# Altium project HVManager.PrjPcb
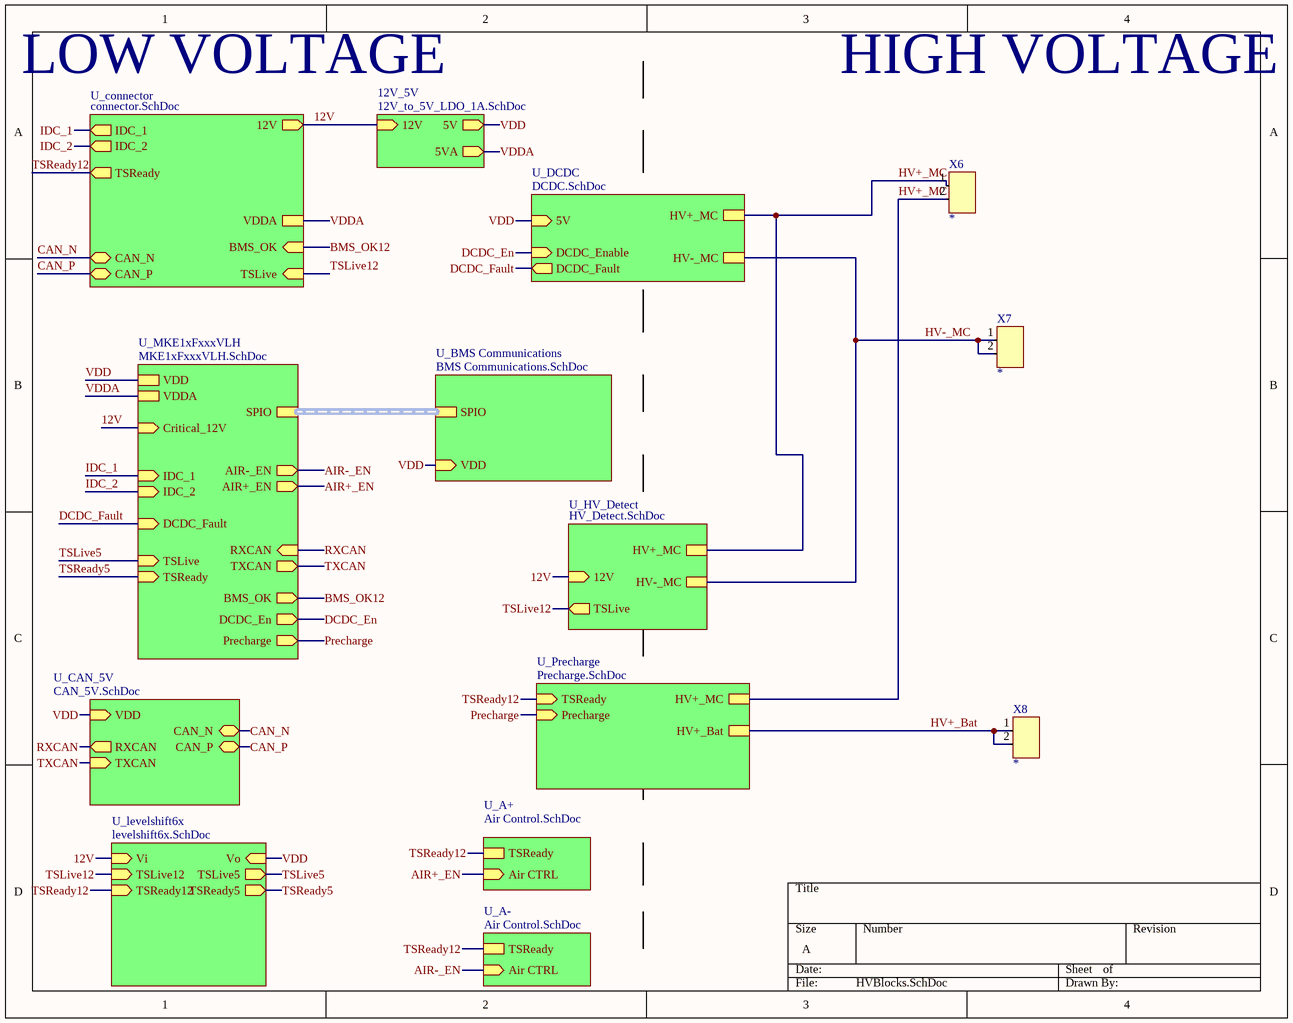
[diagram p0: HVBlocks.SchDoc]
11 sheets, 79 parts. Net scope: hierarchical (ports join the sheet entries above them; power ports are global).
Board file: HV_Manager.PcbDoc
Sheets:
  HVBlocks.SchDoc
    U_A- = Air Control.SchDoc
    U_A+ = Air Control.SchDoc
    U_MKE1xFxxxVLH = MKE1xFxxxVLH.SchDoc
    U_BMS Communications = BMS Communications.SchDoc
    U_connector = connector.SchDoc
    12V_5V = 12V_to_5V_LDO_1A.SchDoc
    U_levelshift6x = levelshift6x.SchDoc
    U_CAN_5V = CAN_5V.SchDoc
    U_DCDC = DCDC.SchDoc
    U_HV_Detect = HV_Detect.SchDoc
    U_Precharge = Precharge.SchDoc

## Sheet HVBlocks.SchDoc
size A

### Parts
X6  *  [CONN 43650-0200 MOLEX 2PIN]
X7  *  [CONN 43650-0200 MOLEX 2PIN]
X8  *  [CONN 43650-0200 MOLEX 2PIN]

### Sub-sheets
12V_5V = 12V_to_5V_LDO_1A.SchDoc: 12V (in), 5V (out), 5VA (out)
U_A+ = Air Control.SchDoc: TSReady, Air CTRL (in)
U_A- = Air Control.SchDoc: TSReady, Air CTRL (in)
U_BMS Communications = BMS Communications.SchDoc: SPIO (harness *), VDD (in)
U_CAN_5V = CAN_5V.SchDoc: TXCAN (in), RXCAN (out), CAN_N (bidir), CAN_P (bidir), VDD (in)
U_connector = connector.SchDoc: 12V (out), TSLive (in), IDC_1 (out), IDC_2 (out), VDDA, CAN_N (bidir), CAN_P (bidir), TSReady (out), BMS_OK (in)
U_DCDC = DCDC.SchDoc: DCDC_Enable (in), HV+_MC, HV-_MC, DCDC_Fault (out), 5V (in)
U_HV_Detect = HV_Detect.SchDoc: HV+_MC, HV-_MC, 12V (in), TSLive (out)
U_levelshift6x = levelshift6x.SchDoc: Vi (in), TSLive12 (in), TSReady12 (in), TSLive5 (out), TSReady5 (out), Vo (in)
U_MKE1xFxxxVLH = MKE1xFxxxVLH.SchDoc: VDD, SPIO (harness *), RXCAN (in), TXCAN (out), AIR-_EN (out), AIR+_EN (out), TSLive (in), VDDA, IDC_1 (in), IDC_2 (in), DCDC_Fault (in), DCDC_En (out), Precharge (out), TSReady (in), BMS_OK (out), Critical_12V (in)
U_Precharge = Precharge.SchDoc: TSReady (in), Precharge (in), HV+_MC, HV+_Bat

### Nets
12V: sheet U_MKE1xFxxxVLH/Critical_12V, sheet U_connector/12V, sheet 12V_5V/12V, sheet U_levelshift6x/Vi, sheet U_HV_Detect/12V
AIR+_EN: sheet U_A+/Air CTRL, sheet U_MKE1xFxxxVLH/AIR+_EN
AIR-_EN: sheet U_A-/Air CTRL, sheet U_MKE1xFxxxVLH/AIR-_EN
BMS_OK12: sheet U_MKE1xFxxxVLH/BMS_OK, sheet U_connector/BMS_OK
CAN_N: sheet U_connector/CAN_N, sheet U_CAN_5V/CAN_N
CAN_P: sheet U_connector/CAN_P, sheet U_CAN_5V/CAN_P
DCDC_En: sheet U_MKE1xFxxxVLH/DCDC_En, sheet U_DCDC/DCDC_Enable
DCDC_Fault: sheet U_MKE1xFxxxVLH/DCDC_Fault, sheet U_DCDC/DCDC_Fault
HV+_Bat: X8.1 X8.2 ; sheet U_Precharge/HV+_Bat
HV+_MC: X6.1 X6.2 ; sheet U_DCDC/HV+_MC, sheet U_HV_Detect/HV+_MC, sheet U_Precharge/HV+_MC
HV-_MC: X7.1 X7.2 ; sheet U_DCDC/HV-_MC, sheet U_HV_Detect/HV-_MC
IDC_1: sheet U_MKE1xFxxxVLH/IDC_1, sheet U_connector/IDC_1
IDC_2: sheet U_MKE1xFxxxVLH/IDC_2, sheet U_connector/IDC_2
Precharge: sheet U_MKE1xFxxxVLH/Precharge, sheet U_Precharge/Precharge
RXCAN: sheet U_MKE1xFxxxVLH/RXCAN, sheet U_CAN_5V/RXCAN
TSLive5: sheet U_MKE1xFxxxVLH/TSLive, sheet U_levelshift6x/TSLive5
TSLive12: sheet U_connector/TSLive, sheet U_levelshift6x/TSLive12, sheet U_HV_Detect/TSLive
TSReady5: sheet U_MKE1xFxxxVLH/TSReady, sheet U_levelshift6x/TSReady5
TSReady12: sheet U_A-/TSReady, sheet U_A+/TSReady, sheet U_connector/TSReady, sheet U_levelshift6x/TSReady12, sheet U_Precharge/TSReady
TXCAN: sheet U_MKE1xFxxxVLH/TXCAN, sheet U_CAN_5V/TXCAN
VDD: sheet U_MKE1xFxxxVLH/VDD, sheet U_BMS Communications/VDD, sheet 12V_5V/5V, sheet U_levelshift6x/Vo, sheet U_CAN_5V/VDD, sheet U_DCDC/5V
VDDA: sheet U_MKE1xFxxxVLH/VDDA, sheet U_connector/VDDA, sheet 12V_5V/5VA

### Buses and harness runs
harness sheet U_BMS Communications/SPIO = sheet U_MKE1xFxxxVLH/SPIO

### Notes on the sheet
- LOW VOLTAGE
- HIGH VOLTAGE

### Library data of the parts
X6-X8 = 9: Molex 43650_0200; id: 9; name: 0436500200; numcontacts: 2; numrows: 1; pitch: 3 mm; MfrPartNo: *; quantity: 0; link: https://www.digikey.com/product-detail/en/molex-llc/0436500200/WM1860-ND/268989

## Sheet Air Control.SchDoc
size A
Used 2 times, as channels U_A-, U_A+. Parts and nets are listed once, with the designators drawn on the sheet.
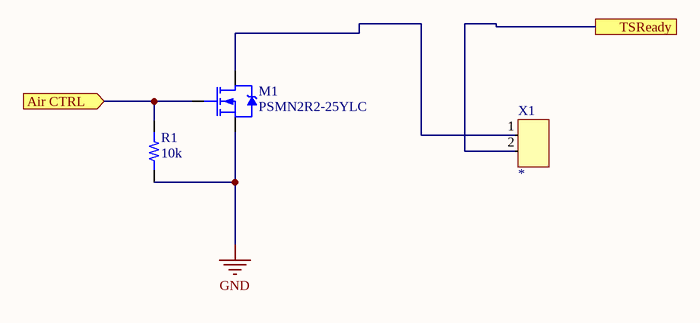
[diagram p1: Air Control.SchDoc]

### Parts
M1  PSMN2R2-25YLC  [POWER-SO8]
R1  10k  [RES 0603/1608]
X1  *  [CONN 43650-0200 MOLEX 2PIN]

### Ports
Air CTRL (in), TSReady

### Nets
GND: M1.S(Source) R1.1
Air CTRL: M1.G(Gate) R1.2 ; port Air CTRL
TSReady: X1.2 ; port TSReady
NetM1_D: M1.D(Drain) X1.1

### Channels
U_A-: designators end in _U_A-; ports Air CTRL=AIR-_EN TSReady=TSReady12
U_A+: designators end in _U_A+; ports Air CTRL=AIR+_EN TSReady=TSReady12

### Library data of the parts
M1 = 3: N-Channel 25V 100A (Tc) 106W (Tc) Surface Mount LFPAK56, Power-SO8; id: 3; vdsmax: 0; numcircuits: 1; rdson: 2.5mOhm; vt: 4.5; vgsmax: 20; MfrPartNo: *; name: PSMN2R2-25YLC; type: N_Channel; current: 100A; package: LFPAK56; quantity: 0; link: https://www.digikey.com/product-detail/en/nexperia-usa-inc/PSMN2R2-25YLC115/1727-5299-1-ND/2674299
R1 = 1: id: 1; name: 0603 Resistor; percent tolerance: 5; resistance: 10k; package: 0603; quantity: 0
X1 = 9: as X6 on sheet HVBlocks; MfrPartNo: *; quantity: 0; link: https://www.digikey.com/product-detail/en/molex-llc/0436500200/WM1860-ND/268989

## Sheet MKE1xFxxxVLH.SchDoc
size A
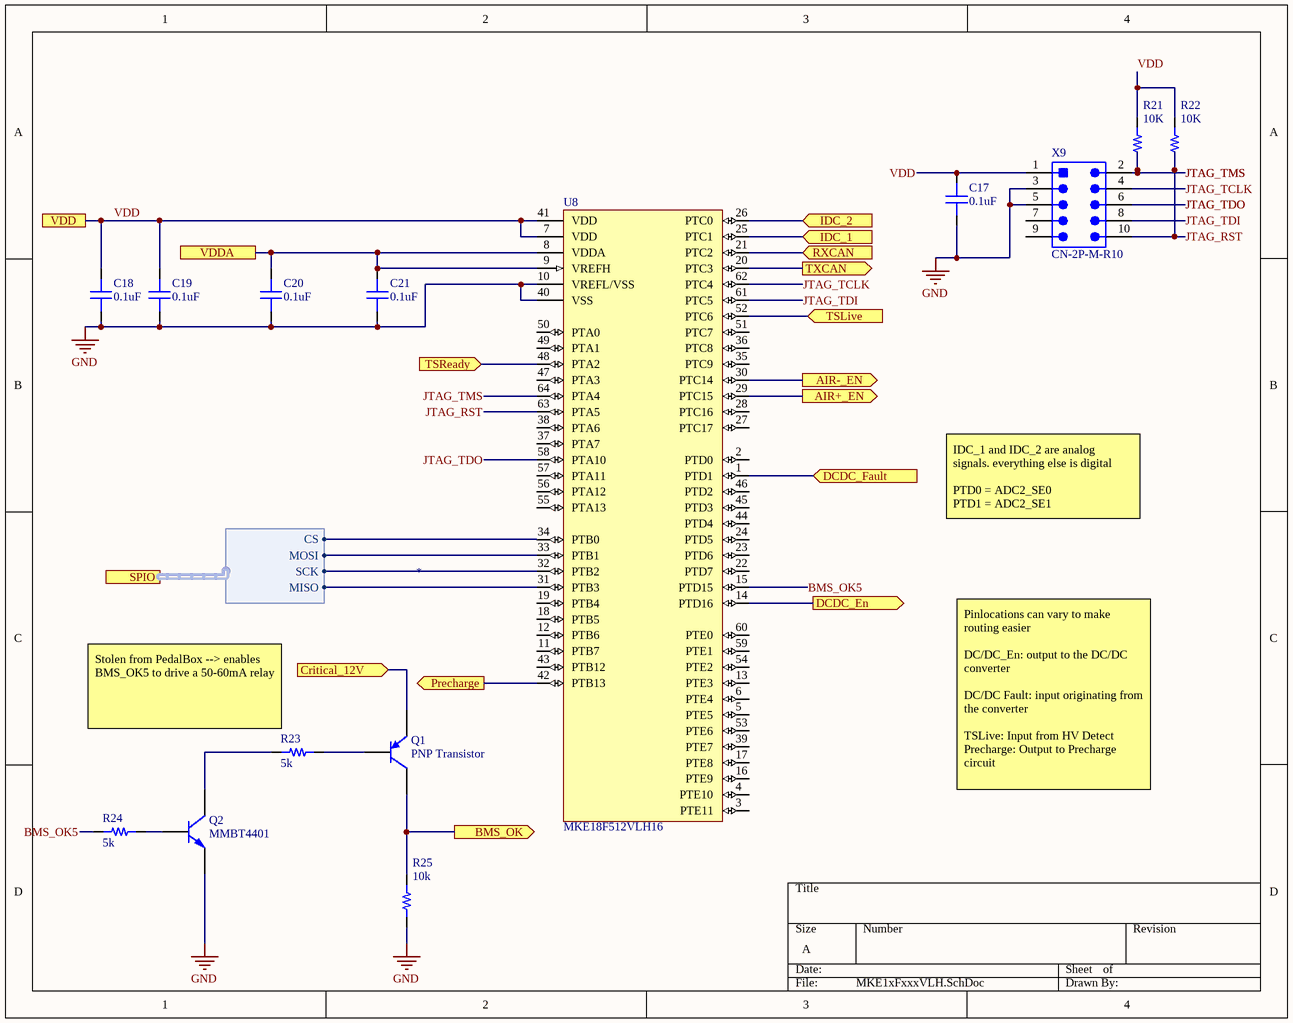
[diagram p2: MKE1xFxxxVLH.SchDoc]

### Parts
C17  capacitance: 0.1uF  [0603]  (hidden comment: capacitor)
C18  capacitance: 0.1uF  [0603]  (hidden comment: capacitor)
C19  capacitance: 0.1uF  [0603]  (hidden comment: capacitor)
C20  capacitance: 0.1uF  [0603]  (hidden comment: capacitor)
C21  capacitance: 0.1uF  [0603]  (hidden comment: capacitor)
Q1  PNP Transistor  [SOT23-3]
Q2  MMBT4401  [SOT23-3]
R21  10K  [RES 0603/1608]
R22  10K  [RES 0603/1608]
R23  5k  [RES 0603/1608]
R24  5k  [RES 0603/1608]
R25  10k  [RES 0603/1608]
U8  MKE18F512VLH16  [TQFP64]
X9  CN-2P-M-R10  [HDR2X5_SMT]

### Ports
AIR+_EN (out), AIR-_EN (out), BMS_OK (out), Critical_12V (in), DCDC_En (out), DCDC_Fault (in), IDC_1 (in), IDC_2 (in), Precharge (out), RXCAN (in), SPIO (harness *), TSLive (in), TSReady (in), TXCAN (out), VDD, VDDA

### Harnesses
*: CS, MOSI, SCK, MISO

### Nets
GND: C17.1 C18.1 C19.1 C20.1 C21.1 Q2.2(E) R25.1 U8.10(VREFL/VSS) U8.40(VSS) X9.3 X9.5
12V: Q1.2(E) ; port Critical_12V
AIR+_EN: U8.29(PTC15) ; port AIR+_EN
AIR-_EN: U8.30(PTC14) ; port AIR-_EN
BMS_OK5: R24.2 U8.15(PTD15)
BMS_OK12: Q1.3(C) R25.2 ; port BMS_OK
DCDC_En: U8.14(PTD16) ; port DCDC_En
DCDC_Fault: U8.1(PTD1) ; port DCDC_Fault
IDC_1: U8.25(PTC1) ; port IDC_1
IDC_2: U8.26(PTC0) ; port IDC_2
JTAG_RST: R22.1 U8.63(PTA5) X9.10
JTAG_TCLK: U8.62(PTC4) X9.4
JTAG_TDI: U8.61(PTC5) X9.8
JTAG_TDO: U8.58(PTA10) X9.6
JTAG_TMS: R21.1 U8.64(PTA4) X9.2
Precharge: U8.42(PTB13) ; port Precharge
RXCAN: U8.21(PTC2) ; port RXCAN
TSLive5: U8.52(PTC6) ; port TSLive
TSReady5: U8.48(PTA2) ; port TSReady
TXCAN: U8.20(PTC3) ; port TXCAN
VDD: C17.2 C18.2 C19.2 R21.2 R22.2 U8.7(VDD) U8.41(VDD) X9.1 ; port VDD
VDDA: C20.2 C21.2 U8.8(VDDA) U8.9(VREFH) ; port VDDA
NetQ1_1: Q1.1(B) R23.1
NetQ2_1: Q2.1(B) R24.1
NetQ2_3: Q2.3(C) R23.2
NetR2_1: U8.31(PTB3) ; port SPIO.MISO
NetR3_2: U8.33(PTB1) ; port SPIO.MOSI
NetU3_4: U8.32(PTB2) ; port SPIO.SCK
NetU3_5: U8.34(PTB0) ; port SPIO.CS

Not connected (* = marked no-connect by the designer): U8 2(PTD0) 3(PTE11) 4(PTE10) 5(PTE5) 6(PTE4) 11(PTB7) 12(PTB6) 13(PTE3) 16(PTE9) 17(PTE8) 18(PTB5) 19(PTB4) 22(PTD7) 23(PTD6) 24(PTD5) 27(PTC17) 28(PTC16) 35(PTC9) 36(PTC8) 37(PTA7) 38(PTA6) 39(PTE7) 43(PTB12) 44(PTD4) 45(PTD3) 46(PTD2) 47(PTA3) 49(PTA1) 50(PTA0) 51(PTC7) 53(PTE6) 54(PTE2) 55(PTA13) 56(PTA12) 57(PTA11) 59(PTE1) 60(PTE0); X9 7 9

### Notes on the sheet
- IDC_1 and IDC_2 are analog signals. everything else is digital
  PTD0 = ADC2_SE0
  PTD1 = ADC2_SE1
- (near R23) Stolen from PedalBox --> enables BMS_OK5 to drive a 50-60mA relay
- Pinlocations can vary to make routing easier
  DC/DC_En: output to the DC/DC converter
  DC/DC Fault: input originating from the converter
  TSLive: Input from HV Detect
  Precharge: Output to Precharge circuit

### Library data of the parts
C17-C21 = 1: Generic 0603 capacitor; id: 1; voltage: 50; dielectric: Ceramic; percent tolerance: 10; name: 0603 Capacitor; ESR: 1; package: 0603; quantity: 0
Q1 = 13: Bipolar (BJT) Transistor PNP 25V 1.5A 100MHz; id: 13; name: MMSS8550-L-TP; power: 625; vcemax: 25; type: PNP; package: SOT23-3; quantity: 0; link: https://www.digikey.com/product-detail/en/micro-commercial-co/MMSS8550-L-TP/MMSS8550-L-TPMSCT-ND/2827205; createdby: Kevin; createddate: 10/16/2019 7:23:00 AM
Q2 = 2: id: 2; type: NPN; name: MMBT4401; package: SOT23-3; quantity: 0; link: https://www.digikey.com/product-detail/en/diodes-incorporated/MMBT4401-7-F/MMBT4401-FDICT-ND/775867
R21-R25 = 1: as R1 on sheet Air Control; package: 0603; quantity: 0
  R21 R22: resistance: 10K
  R23 R24: resistance: 5k
  R25: resistance: 10k
U8 = 1: 32b NXP Microcontroller; id: 1; Vcc: 2.7-5.5; Name: MKE18F512VLH16; package: TQFP64; quantity: 0
X9 = 4: CONN_TE_2X5POS; id: 4; name: 5103309-1; numcontacts: 10; numrows: 2; pitch: 2.54mm; MfrPartNo: *; link: https://www.digikey.com/product-detail/en/5103309-1/A33160-ND/1114898?utm_campaign=buynow&WT.z_cid=ref_octopart_dkc_buynow&utm_medium=aggregator&curr=usd&site=us&utm_source=octopart; quantity: 0

## Sheet BMS Communications.SchDoc
size A
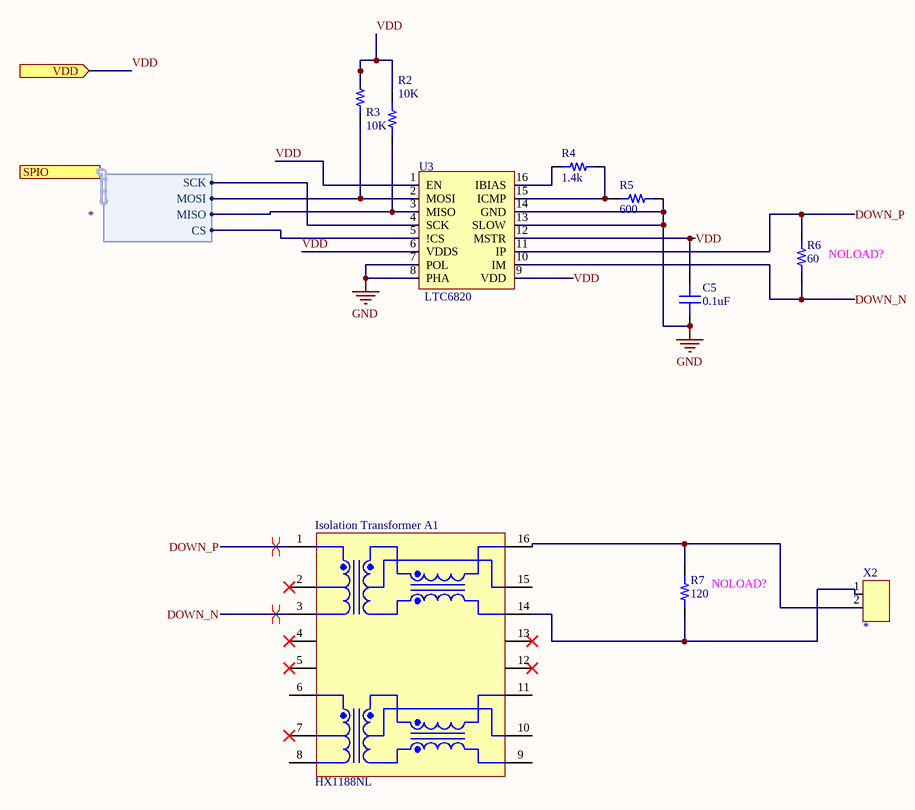
[diagram p3: BMS Communications.SchDoc]

### Parts
C5  capacitance: 0.1uF  [0603]  (hidden comment: capacitor)
Isolation_Transformer_A1  HX1188NL  [PULS-MODULE-16_V]
R2  10K  [RES 0603/1608]
R3  10K  [RES 0603/1608]
R4  1.4k  [RES 0603/1608]
R5  600  [RES 0603/1608]
R6  60  [RES 0603/1608]
R7  120  [RES 0603/1608]
U3  LTC6820  [MSOP-16]
X2  *  [CONN 43650-0200 MOLEX 2PIN]

### Ports
SPIO (harness *), VDD (in)

### Harnesses
*: SCK, MOSI, MISO, CS

### Nets
GND: C5.1 R5.1 U3.7(POL) U3.8(PHA) U3.13(SLOW) U3.14(GND)
DOWN_N: Isolation_Transformer_A1.3 R6.1 U3.10(IM)
DOWN_P: Isolation_Transformer_A1.1 R6.2 U3.11(IP)
VDD: C5.2 R2.2 R3.1 U3.1(EN) U3.6(VDDS) U3.9(VDD) U3.12(MSTR) ; port VDD
NetIsolation_Transformer_A1_14: Isolation_Transformer_A1.14 R7.1 X2.1
NetIsolation_Transformer_A1_16: Isolation_Transformer_A1.16 R7.2 X2.2
NetR2_1: R2.1 U3.3(MISO) ; port SPIO.MISO
NetR3_2: R3.2 U3.2(MOSI) ; port SPIO.MOSI
NetR4_1: R4.1 R5.2 U3.15(ICMP)
NetR4_2: R4.2 U3.16(IBIAS)
NetU3_4: U3.4(SCK) ; port SPIO.SCK
NetU3_5: U3.5(!CS) ; port SPIO.CS

Not connected (* = marked no-connect by the designer): Isolation_Transformer_A1 2* 4* 5* 6 7* 8 9 10 11 12* 13* 15

### Layout directives
differential pair: DOWN_N, DOWN_P

### Notes on the sheet
- (near R6) NOLOAD?
- (near R7) NOLOAD?

### Library data of the parts
C5 = 1: as C17 on sheet MKE1xFxxxVLH; name: 0603 Capacitor; ESR: 1; package: 0603; quantity: 0
Isolation_Transformer_A1 = CMP-2000-05323-1: 10/100 Base-T Single Port Surface Mount Magnetic with Turns Ratio, -40 to 85 degC, 16-Pin Module, RoHS, Tube; Manufacturer: Pulse Electronics; Other Related Documents: PackagesFNLvs.NL; Other Names: 553-1340; PCN Design/Specification: ThermoplasticHeaderDesign28/Jun/2013; Transformer Type: IsolationandDataInterface(Encapsulated); PCN Other: HaloInjunctionRes1/Sep/2015; Turns Ratio - Primary: Secondary:1:1Transmitter,1:1Receiver; Family: PulseTransformers; Datasheet URL: https://datasheet.ciiva.com/26929/hx1188nl-26929858.pdf; Mounting Type: SurfaceMount; Size / Dimension: 12.70mmLx7.11mmW; Inductance: -; Package Description: 16-Pin Surface Mount Device, Body 12.7 x 7.11 mm, Pitch 1.27 mm; Height - Seated (Max): 6.22mm; E.T.: -; Online Catalog: 10/100BASE-TSinglePort; Manufacturer URL: http://www.pulseelectronics.com/; Package Reference: MODULE-16; Series: -; Category: Transformers; Standard Package: 40; Datasheet Version: Rev. H325.Q, 09/2009
R2-R7 = 1: as R1 on sheet Air Control; package: 0603; quantity: 0
  R2 R3: resistance: 10K
  R4: resistance: 1.4k
  R5: resistance: 600
  R6: resistance: 60
  R7: resistance: 120
U3 = 7: soSPI Isolated / Communications Interface; Manufacturer_id: 1; idFuse: 3; Name: null; id: 7; vcc: 0; Drawer_id: 1; type: isoSPI; package: MSOP-16; quantity: 0; link: https://www.mouser.com/ProductDetail/Analog-Devices/LTC6820IMSPBF?qs=sGAEpiMZZMvi6wO7nhr1LyTLeBC7dAWQpR44bZH0zYY%3d
X2 = 9: as X6 on sheet HVBlocks; MfrPartNo: *; quantity: 0; link: https://www.digikey.com/product-detail/en/molex-llc/0436500200/WM1860-ND/268989

## Sheet connector.SchDoc
size A
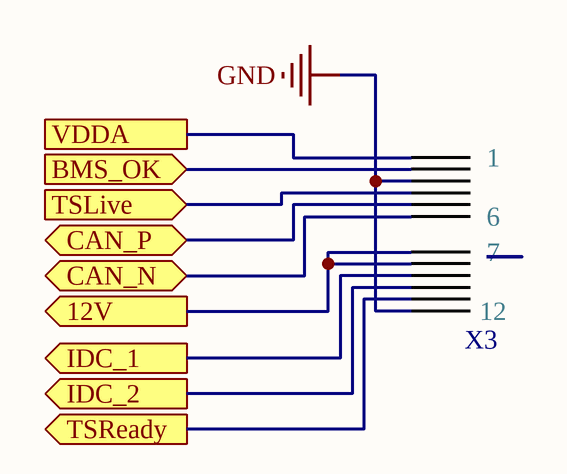
[diagram p4: connector.SchDoc]

### Parts
X3  4-794619-2  [4-794619-2]  (value not drawn)

### Ports
12V (out), BMS_OK (in), CAN_N (bidir), CAN_P (bidir), IDC_1 (out), IDC_2 (out), TSLive (in), TSReady (out), VDDA

### Nets
GND: X3.3 X3.12
12V: X3.7 X3.8 ; port 12V
BMS_OK12: X3.2 ; port BMS_OK
CAN_N: X3.6 ; port CAN_N
CAN_P: X3.5 ; port CAN_P
IDC_1: X3.9 ; port IDC_1
IDC_2: X3.10 ; port IDC_2
TSLive12: X3.4 ; port TSLive
TSReady12: X3.11 ; port TSReady
VDDA: X3.1 ; port VDDA

### Library data of the parts
X3 = 41: 12p te; id: 41; numcontacts: 12; numrows: 2; pitch: 3mm; name: 4-794619-2; quantity: 0; link: https://www.digikey.com/product-detail/en/te-connectivity-amp-connectors/4-794619-2/A115204-ND/2286935

## Sheet 12V_to_5V_LDO_1A.SchDoc
size A
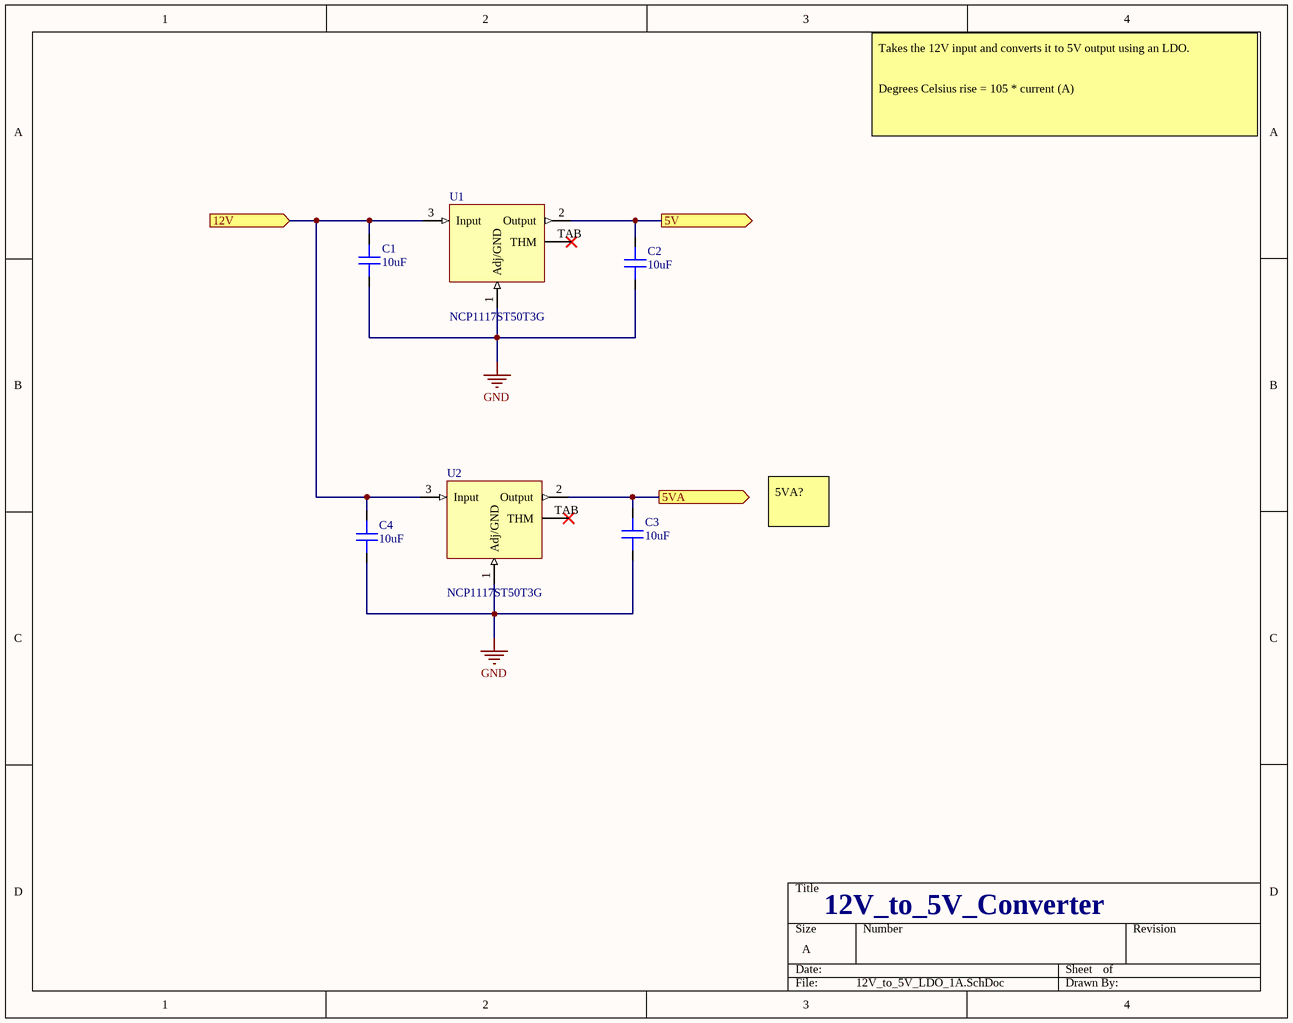
[diagram p5: 12V_to_5V_LDO_1A.SchDoc]

### Parts
C1  capacitance: 10uF  [0603]  (hidden comment: capacitor)
C2  capacitance: 10uF  [0603]  (hidden comment: capacitor)
C3  capacitance: 10uF  [0603]  (hidden comment: capacitor)
C4  capacitance: 10uF  [0603]  (hidden comment: capacitor)
U1  NCP1117ST50T3G  [SOT-223-3]
U2  NCP1117ST50T3G  [SOT-223-3]

### Ports
5V (out), 5VA (out), 12V (in)

### Nets
GND: C1.1 C2.1 C3.1 C4.1 U1.1(Adj/GND) U2.1(Adj/GND)
12V: C1.2 C4.2 U1.3(Input) U2.3(Input) ; port 12V
VDD: C2.2 U1.2(Output) ; port 5V
VDDA: C3.2 U2.2(Output) ; port 5VA

Not connected (* = marked no-connect by the designer): U1 TAB(THM)*; U2 TAB(THM)*

### Notes on the sheet
- Takes the 12V input and converts it to 5V output using an LDO.
  Degrees Celsius rise = 105 * current (A)
- 5VA?
- 12V_to_5V_Converter

### Library data of the parts
C1-C4 = 1: as C17 on sheet MKE1xFxxxVLH; name: 0603 Capacitor; ESR: 1; package: 0603; quantity: 0
U1 U2 = 16: 5V linear regulator; id: 16; imax: 1; name: NCP1117ST50T3G; package: SOT-223-3; quantity: 0; link: https://www.digikey.com/product-detail/en/on-semiconductor/NCP1117ST50T3G/NCP1117ST50T3GOSCT-ND/1967217

## Sheet levelshift6x.SchDoc
size A
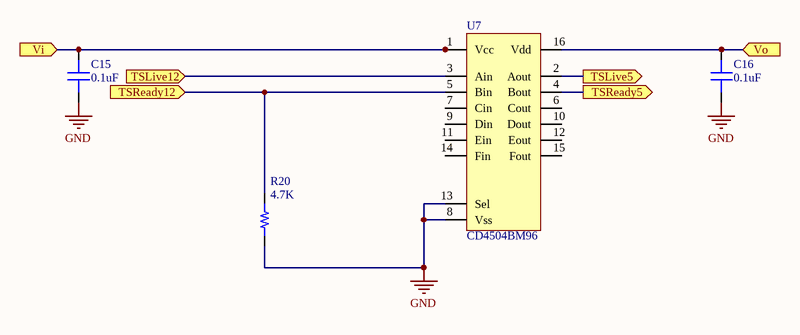
[diagram p6: levelshift6x.SchDoc]

### Parts
C15  capacitance: 0.1uF  [0603]  (hidden comment: capacitor)
C16  capacitance: 0.1uF  [0603]  (hidden comment: capacitor)
R20  4.7K  [RES 0603/1608]
U7  CD4504BM96  [SOIC-16]

### Ports
TSLive5 (out), TSLive12 (in), TSReady5 (out), TSReady12 (in), Vi (in), Vo (in)

### Nets
GND: C15.1 C16.1 R20.1 U7.8(Vss) U7.13(Sel)
12V: C15.2 U7.1(Vcc) ; port Vi
TSLive5: U7.2(Aout) ; port TSLive5
TSLive12: U7.3(Ain) ; port TSLive12
TSReady5: U7.4(Bout) ; port TSReady5
TSReady12: R20.2 U7.5(Bin) ; port TSReady12
VDD: C16.2 U7.16(Vdd) ; port Vo

Not connected (* = marked no-connect by the designer): U7 6(Cout) 7(Cin) 9(Din) 10(Dout) 11(Ein) 12(Eout) 14(Fin) 15(Fout)

### Library data of the parts
C15 C16 = 1: as C17 on sheet MKE1xFxxxVLH; name: 0603 Capacitor; ESR: 1; package: 0603; quantity: 0
R20 = 1: as R1 on sheet Air Control; resistance: 4.7K; package: 0603; quantity: 0
U7 = 1: Voltage Level Translator Unidirectional 1 Cir; id: 1; vcc: 20; name: CD4504BM96; type: Level shifter CMOS-CMOS; package: SOIC-16; quantity: 0; link: https://www.digikey.com/product-detail/en/texas-instruments/CD4504BM96/296-14150-2-ND/525968

## Sheet CAN_5V.SchDoc
size A
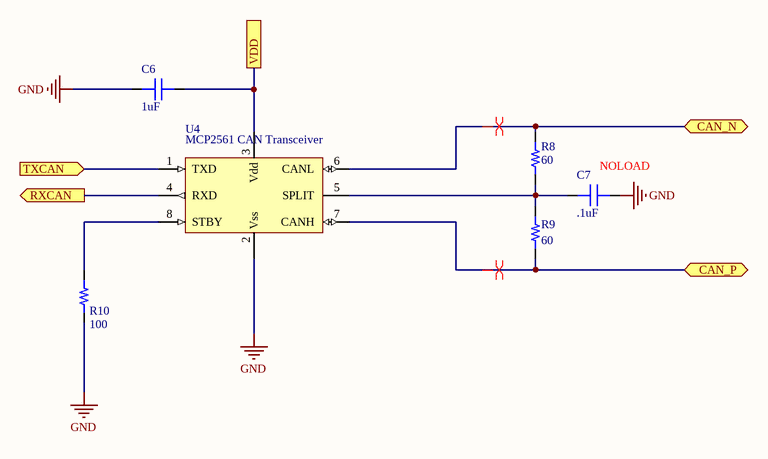
[diagram p7: CAN_5V.SchDoc]

### Parts
C6  capacitance: 1uF  [0603]  (hidden comment: capacitor)
C7  capacitance: .1uF  [0603]  (hidden comment: capacitor)
R8  60  [RES 0603/1608]
R9  60  [RES 0603/1608]
R10  100  [RES 0603/1608]
U4  MCP2561 CAN Transceiver  [SOIC-8]

### Ports
CAN_N (bidir), CAN_P (bidir), RXCAN (out), TXCAN (in), VDD

### Nets
GND: C6.1 C7.2 R10.2 U4.2(Vss)
CAN_N: R8.2 U4.6(CANL) ; port CAN_N
CAN_P: R9.2 U4.7(CANH) ; port CAN_P
RXCAN: U4.4(RXD) ; port RXCAN
TXCAN: U4.1(TXD) ; port TXCAN
VDD: C6.2 U4.3(Vdd) ; port VDD
NetC7_1: C7.1 R8.1 R9.1 U4.5(SPLIT)
NetR10_1: R10.1 U4.8(STBY)

### Layout directives
differential pair: CAN_N, CAN_P

### Notes on the sheet
- (near C7) NOLOAD

### Library data of the parts
C6 C7 = 1: as C17 on sheet MKE1xFxxxVLH; name: 0603 Capacitor; ESR: 1; package: 0603; quantity: 0
R8-R10 = 1: as R1 on sheet Air Control; package: 0603; quantity: 0
  R8 R9: resistance: 60
  R10: resistance: 100
U4 = 5: id: 5; name: null; vcc: 0; type: CAN; package: SOIC-8; quantity: 0; link: https://www.digikey.com/product-detail/en/microchip-technology/MCP2561T-E-SN/MCP2561T-E-SNCT-ND/5148846

## Sheet DCDC.SchDoc
size A
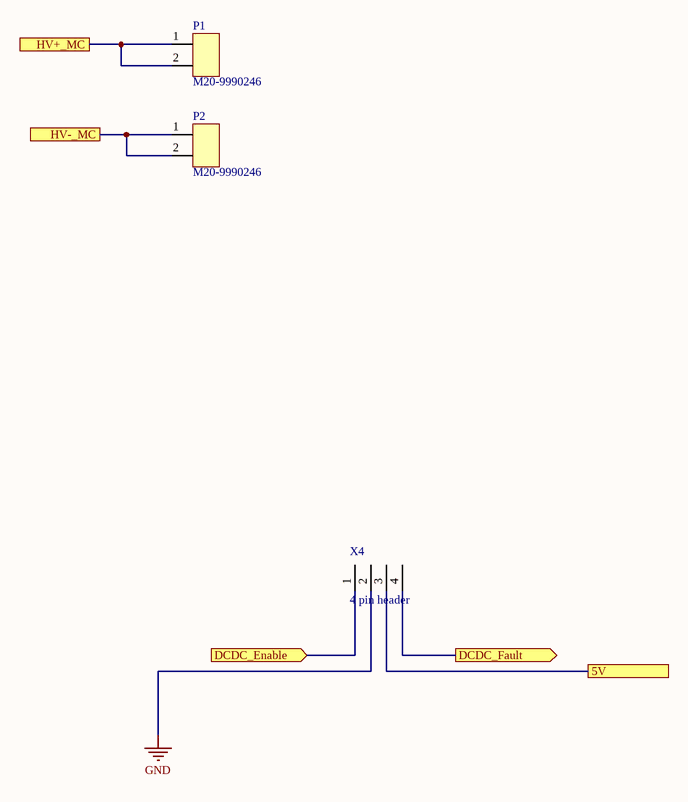
[diagram p8: DCDC.SchDoc]

### Parts
P1  M20-9990246  [M20-9990246]
P2  M20-9990246  [M20-9990246]
X4  4 pin header  [4pinheader]

### Ports
5V, DCDC_Enable (in), DCDC_Fault (out), HV+_MC, HV-_MC

### Nets
GND: X4.2
DCDC_En: X4.1 ; port DCDC_Enable
DCDC_Fault: X4.4 ; port DCDC_Fault
HV+_MC: P1.1 P1.2 ; port HV+_MC
HV-_MC: P2.1 P2.2 ; port HV-_MC
VDD: X4.3 ; port 5V

### Library data of the parts
P1 P2 = 25: 2 Pin VCC Power Header, Male; Manufacturer_id: 1; idConn: 25; Value: CONN; Voltage_Rating: Null; Num_Contacts: 2; Pitch: 2.54; Created_By: Austin; Drawer_id: 1; Name: M20-9990246; Num_Rows: Null; Package: Conn; MfrPartNo: M20-9990246; Link: https://www.digikey.com/product-detail/en/harwin-inc/M20-9990246/952-2262-ND/3728226; ComponentLink1Description: Null; ComponentLink1URL: https://www.digikey.com/product-detail/en/harwin-inc/M20-9990246/952-2262-ND/3728226; Supplier1: Digi-Key; Supplier1PartNo: 952-2262-ND; Created_Date: 12/15/2018; Updated_By: Null
X4 = 40: id: 40; numcontacts: 4; numrows: 1; pitch: .1in; name: 4pinheader; quantity: 0; package: .1in

## Sheet HV_Detect.SchDoc
size A
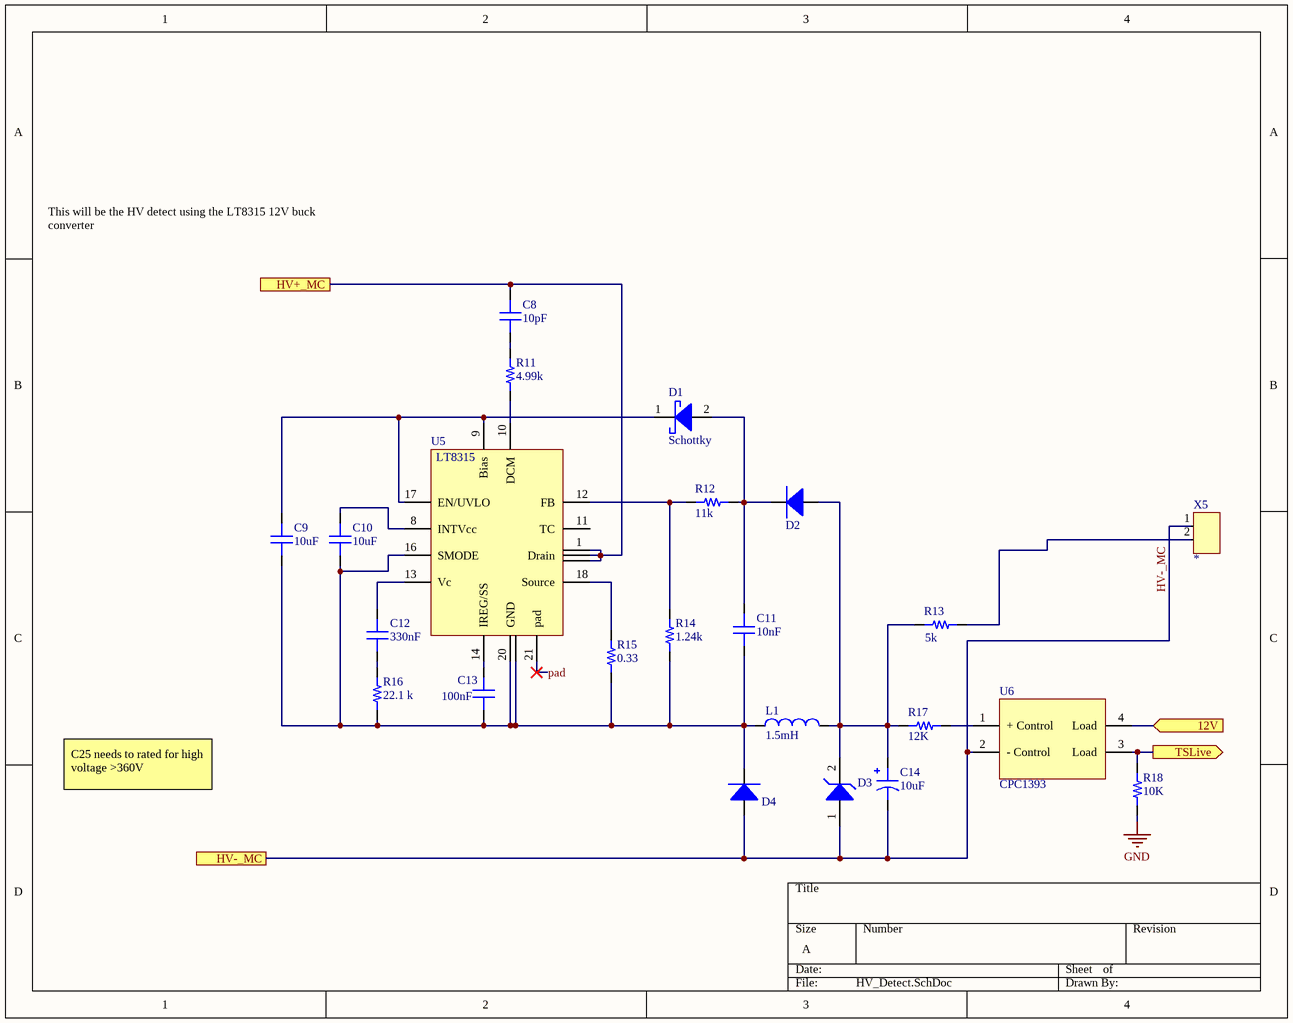
[diagram p9: HV_Detect.SchDoc]

### Parts
C8  capacitance: 10pF  [CAP 0805/2012]
C9  capacitance: 10uF  [0603]  (hidden comment: capacitor)
C10  capacitance: 10uF  [0603]  (hidden comment: capacitor)
C11  capacitance: 10nF  [0603]  (hidden comment: capacitor)
C12  capacitance: 330nF  [0603]  (hidden comment: capacitor)
C13  capacitance: 100nF  [0603]  (hidden comment: capacitor)
C14  capacitance: 10uF  [CMMR1U-06]  (hidden comment: Capacitor_Electrolytic)
D1  Schottky  [SOD323]
D2  diode  [CMMR1U-06]  (value not drawn)
D3  *  [SOD123F]  (value not drawn)
D4  diode  [C3D1P7060Q]  (value not drawn)
L1  1.5mH  [SDR1005]
R11  4.99k  [RES 0603/1608]
R12  11k  [RES 0603/1608]
R13  5k  [RES 0603/1608]
R14  1.24k  [RES 0603/1608]
R15  0.33  [RES 0603/1608]
R16  22.1 k  [RES 0603/1608]
R17  12K  [RES 0603/1608]
R18  10K  [RES 0603/1608]
U5  LT8315  [TSSOP20-Thermal]
U6  CPC1393  [CPC1393GR]
X5  *  [CONN 43650-0200 MOLEX 2PIN]

### Ports
12V (in), HV+_MC, HV-_MC, TSLive (out)

### Nets
GND: R18.1
12V: U6.4(Load) ; port 12V
HV+_MC: C8.2 U5.1(Drain) U5.2(Drain) U5.3(Drain) ; port HV+_MC
HV-_MC: C14.2 D3.1(A) D4.2 U6.2(-_Control) X5.1 ; port HV-_MC
pad: U5.21(pad)
TSLive12: R18.2 U6.3(Load) ; port TSLive
NetC8_1: C8.1 R11.1
NetC9_1: C9.1 D1.1(K) U5.9(Bias) U5.17(EN/UVLO)
NetC9_2: C9.2 C10.2 C11.1 C13.1 D4.1 L1.1 R14.1 R15.1 R16.2 U5.15(GND) U5.16(SMODE) U5.20(GND)
NetC10_1: C10.1 U5.8(INTVcc)
NetC11_2: C11.2 D1.2(A) D2.1 R12.2
NetC12_1: C12.1 R16.1
NetC12_2: C12.2 U5.13(Vc)
NetC13_2: C13.2 U5.14(IREG/SS)
NetC14_1: C14.1 D2.2 D3.2(K) L1.2 R13.1 R17.1
NetR11_2: R11.2 U5.10(DCM)
NetR12_1: R12.1 R14.2 U5.12(FB)
NetR13_2: R13.2 X5.2
NetR15_2: R15.2 U5.18(Source)
NetR17_2: R17.2 U6.1(+_Control)

Not connected (* = marked no-connect by the designer): U5 11(TC)

### Notes on the sheet
- This will be the HV detect using the LT8315 12V buck converter
- C25 needs to rated for high voltage >360V

### Library data of the parts
C8 = 9: 10pF 500V Ceramic 0805; id: 9; name: CC0805JRNPOBBN100; voltage: 500; percent tolerance: 5; updatedby: Eric Tse; dielectric: Ceramic; quantity: 1; link: https://www.digikey.com/product-detail/en/yageo/CC0805JRNPOBBN100/311-4254-1-ND/8025343; createdby: Eric Tse; createddate: 12/15/2019 9:33:53 PM; updateddate: 12/15/2019 9:33:53 PM
C9-C13 = 1: as C17 on sheet MKE1xFxxxVLH; name: 0603 Capacitor; ESR: 1; package: 0603; quantity: 0
C14 = 10: 10µF 400V Aluminum Electrolytic Capacitors Ra; id: 10; name: ULV2G100MNL1GS; voltage: 400; percent tolerance: 20; ESR: 0; package: SMD Can; quantity: 0; link: https://www.digikey.com/product-detail/en/nichicon/ULV2G100MNL1GS/493-6741-1-ND/3664308
D1 = 27: 30V 200mA schottky diode; id: 27; name: CMDSH2-3; vr: 30; numcircuits: 1; updatedby: Eric Tse; quantity: 1; createdby: Eric Tse; createddate: 11/20/2019 6:50:55 PM; updateddate: 11/20/2019 6:50:55 PM
D2 = 28: Diode Standard 600V 1A Surface Mount SOD-123F; id: 28; vr: 600; numcircuits: 1; name: CMMR1U-06; package: SOD-123F; quantity: 0; link: https://www.digikey.com/product-detail/en/central-semiconductor-corp/CMMR1U-06-TR-PBFREE/1514-CMMR1U-06TRPBFREECT-ND/4807015
D3 = 10: Zener Diode 14V 500mW ±5% Surface Mount SOD-1; id: 10; name: DDZ9701; MfrPartNo: *; package: SOD-123; quantity: 0; link: https://www.digikey.com/product-detail/en/diodes-incorporated/DDZ9701-7/DDZ9701-7DICT-ND/3877402
D4 = 29: Diode Silicon Carbide Schottky 600V 9.7A (DC); id: 29; vr: 600; numcircuits: 1; name: C3D1P7060Q; package: QFN; quantity: 0; link: https://www.digikey.com/product-detail/en/cree-wolfspeed/C3D1P7060Q/C3D1P7060QCT-ND/3586865
L1 = 11: 1.5mH inductor; id: 11; imax: 0.25; tolerance: 10; resistance: 6.3; updatedby: Marc Wong; name: SDR1005; inductance: 1.5mH; package: SDR1005; quantity: 1; link: https://www.digikey.com/product-detail/en/bourns-inc/SDR1005-152KL/SDR1005-152KLCT-ND/2127182; createdby: Marc Wong; createddate: 11/22/2019 11:10:33 PM; updateddate: 11/22/2019 11:10:33 PM
R11-R18 = 1: as R1 on sheet Air Control; package: 0603; quantity: 0
  R11: resistance: 4.99k
  R12: resistance: 11k
  R13: resistance: 5k
  R14: resistance: 1.24k
  R15: resistance: 0.33
  R16: resistance: 22.1 k
  R17: resistance: 12K
  R18: resistance: 10K
U5 = 19: 560Vin - 12Vout Buck Converter; id: 19; imax: 0.119999997317791; updatedby: Eric Tse; name: LT8315; quantity: 1; link: https://www.digikey.com/en/product-highlight/l/linear-tech/lt8315-isolated-flyback-converter; createdby: Eric Tse; createddate: 11/20/2019 18:54:34; updateddate: 11/20/2019 18:54:34
U6 = 26: Solid State Relay SPST-NO (1 Form A) 4-SMD (0.300", 7.62mm); Manufacturer_id: 1; MfrPartNo: CPC1393GRTR; idIC_Misc: 26; Value: Null; Created_By: Lynette; Drawer_id: 1; Name: CPC1393; Type: Null; Protocol: Null; Num_Circuits: 1; Data_Rate: Null; Vin(Min): Null; Vin(Max): Null; Package: CPC1393GR; Link: https://www.digikey.com/product-detail/en/ixys-integrated-circuits-division/CPC1393GRTR/CLA270CT-ND/1277144; ComponentLink1Description: Null; ComponentLink1URL: Null; Supplier1: Null; Supplier1PartNo: Null; Updated_By: Null
X5 = 9: as X6 on sheet HVBlocks; MfrPartNo: *; quantity: 0; link: https://www.digikey.com/product-detail/en/molex-llc/0436500200/WM1860-ND/268989

## Sheet Precharge.SchDoc
size A
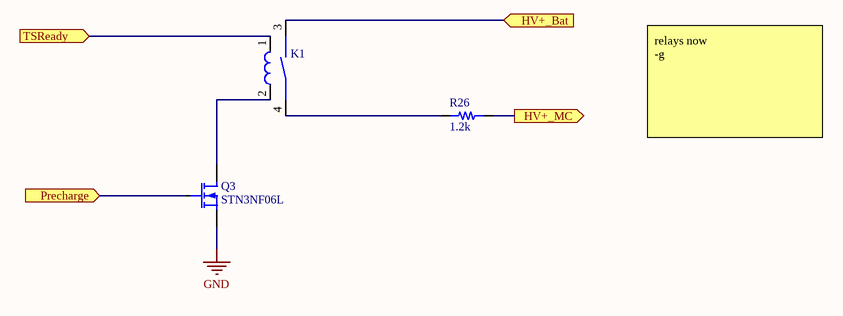
[diagram p10: Precharge.SchDoc]

### Parts
K1  LI24-1A85  [LI24-1A85]  (value not drawn)
Q3  STN3NF06L  [STN3NF06L]
R26  value 1.2k  [AP101]  (hidden comment: Resistor 1k2 100W 1% Throughhole)

### Ports
HV+_Bat (in), HV+_MC (out), Precharge (in), TSReady (in)

### Nets
GND: Q3.3(S)
HV+_Bat: K1.3 ; port HV+_Bat
HV+_MC: R26.2 ; port HV+_MC
Precharge: Q3.1(G) ; port Precharge
TSReady12: K1.1 ; port TSReady
NetK1_2: K1.2 Q3.2(D)
NetK1_4: K1.4 R26.1

### Notes on the sheet
- relays now
  -g

### Library data of the parts
K1 = 3: RELAY REED SPST 1A 24V; id: 3; current: 1; voltage: 12; name: LI24-1A85; type: Reed; quantity: 0; link: https://www.digikey.com/product-detail/en/standex-meder-electronics/LI24-1A85/374-1296-ND/2208755; createdby: gray
Q3 = 8: MOSFET N-CH 60V 4A SOT223; id: 8; type: N_Channel; vdsmax: 0; numcircuits: 1; rdson: 70m; name: STN3NF06L; current: 4A; vgsmax: 0; package: SOT-233; quantity: 0; link: https://www.digikey.com/product-detail/en/stmicroelectronics/STN3NF06L/497-3177-1-ND/654516
R26 = 2705: 100W Throughhole Resistor; Manufacturer_id: 1; idResistor: 2705; Name: AP101 1K2 J; Tolerance: 5%; Created_By: Graydon; Supplier 1: Digi-Key; Supplier Part Number 1: AP1011K2J-ND; Drawer_id: 1; Power: 100W; Package: TO-247-2; MfrPartNo: AP101 1K2 J; Link: https://www.digikey.com/short/jvdcjz; ComponentLink1Description: Datasheet; ComponentLink1URL: https://www.ohmite.com/assets/docs/acl_ap101.pdf?r=false; Created_Date: 2018-11-24

## Nets that join several sheets
GND: U_A- (M1_U_A-.S R1_U_A-.1), U_A+ (M1_U_A+.S R1_U_A+.1), MKE1xFxxxVLH (11 pins), BMS Communications (6 pins), connector (X3.3 X3.12), 12V_to_5V_LDO_1A (6 pins), levelshift6x (5 pins), CAN_5V (C6.1 C7.2 R10.2 U4.2), DCDC (X4.2), HV_Detect (R18.1), Precharge (Q3.3)
12V: MKE1xFxxxVLH (Q1.2), connector (X3.7 X3.8), 12V_to_5V_LDO_1A (C1.2 C4.2 U1.3 U2.3), levelshift6x (C15.2 U7.1), HV_Detect (U6.4)
AIR+_EN: U_A+ (M1_U_A+.G R1_U_A+.2), MKE1xFxxxVLH (U8.29)
AIR-_EN: U_A- (M1_U_A-.G R1_U_A-.2), MKE1xFxxxVLH (U8.30)
BMS_OK12: MKE1xFxxxVLH (Q1.3 R25.2), connector (X3.2)
CAN_N: connector (X3.6), CAN_5V (R8.2 U4.6)
CAN_P: connector (X3.5), CAN_5V (R9.2 U4.7)
DCDC_En: MKE1xFxxxVLH (U8.14), DCDC (X4.1)
DCDC_Fault: MKE1xFxxxVLH (U8.1), DCDC (X4.4)
HV+_Bat: HVBlocks (X8.1 X8.2), Precharge (K1.3)
HV+_MC: HVBlocks (X6.1 X6.2), DCDC (P1.1 P1.2), HV_Detect (C8.2 U5.1 U5.2 U5.3), Precharge (R26.2)
HV-_MC: HVBlocks (X7.1 X7.2), DCDC (P2.1 P2.2), HV_Detect (5 pins)
IDC_1: MKE1xFxxxVLH (U8.25), connector (X3.9)
IDC_2: MKE1xFxxxVLH (U8.26), connector (X3.10)
NetR2_1: MKE1xFxxxVLH (U8.31), BMS Communications (R2.1 U3.3)
NetR3_2: MKE1xFxxxVLH (U8.33), BMS Communications (R3.2 U3.2)
NetU3_4: MKE1xFxxxVLH (U8.32), BMS Communications (U3.4)
NetU3_5: MKE1xFxxxVLH (U8.34), BMS Communications (U3.5)
Precharge: MKE1xFxxxVLH (U8.42), Precharge (Q3.1)
RXCAN: MKE1xFxxxVLH (U8.21), CAN_5V (U4.4)
TSLive5: MKE1xFxxxVLH (U8.52), levelshift6x (U7.2)
TSLive12: connector (X3.4), levelshift6x (U7.3), HV_Detect (R18.2 U6.3)
TSReady5: MKE1xFxxxVLH (U8.48), levelshift6x (U7.4)
TSReady12: U_A- (X1_U_A-.2), U_A+ (X1_U_A+.2), connector (X3.11), levelshift6x (R20.2 U7.5), Precharge (K1.1)
TXCAN: MKE1xFxxxVLH (U8.20), CAN_5V (U4.1)
VDD: MKE1xFxxxVLH (8 pins), BMS Communications (7 pins), 12V_to_5V_LDO_1A (C2.2 U1.2), levelshift6x (C16.2 U7.16), CAN_5V (C6.2 U4.3), DCDC (X4.3)
VDDA: MKE1xFxxxVLH (C20.2 C21.2 U8.8 U8.9), connector (X3.1), 12V_to_5V_LDO_1A (C3.2 U2.2)